# Altium schematic sheet AVR128DB48_Curiosity_Nano_Revision_History.SchDoc
size A3; SheetTitle: Revision History; CompanyName: Microchip Technology Inc.; Organization: Microchip Technology; Address1: 2355 West Chandler Blvd.; Address2: Chandler, AZ  85224; Address4: USA; SheetNumber: 4; SheetTotal: 4; Time: Time
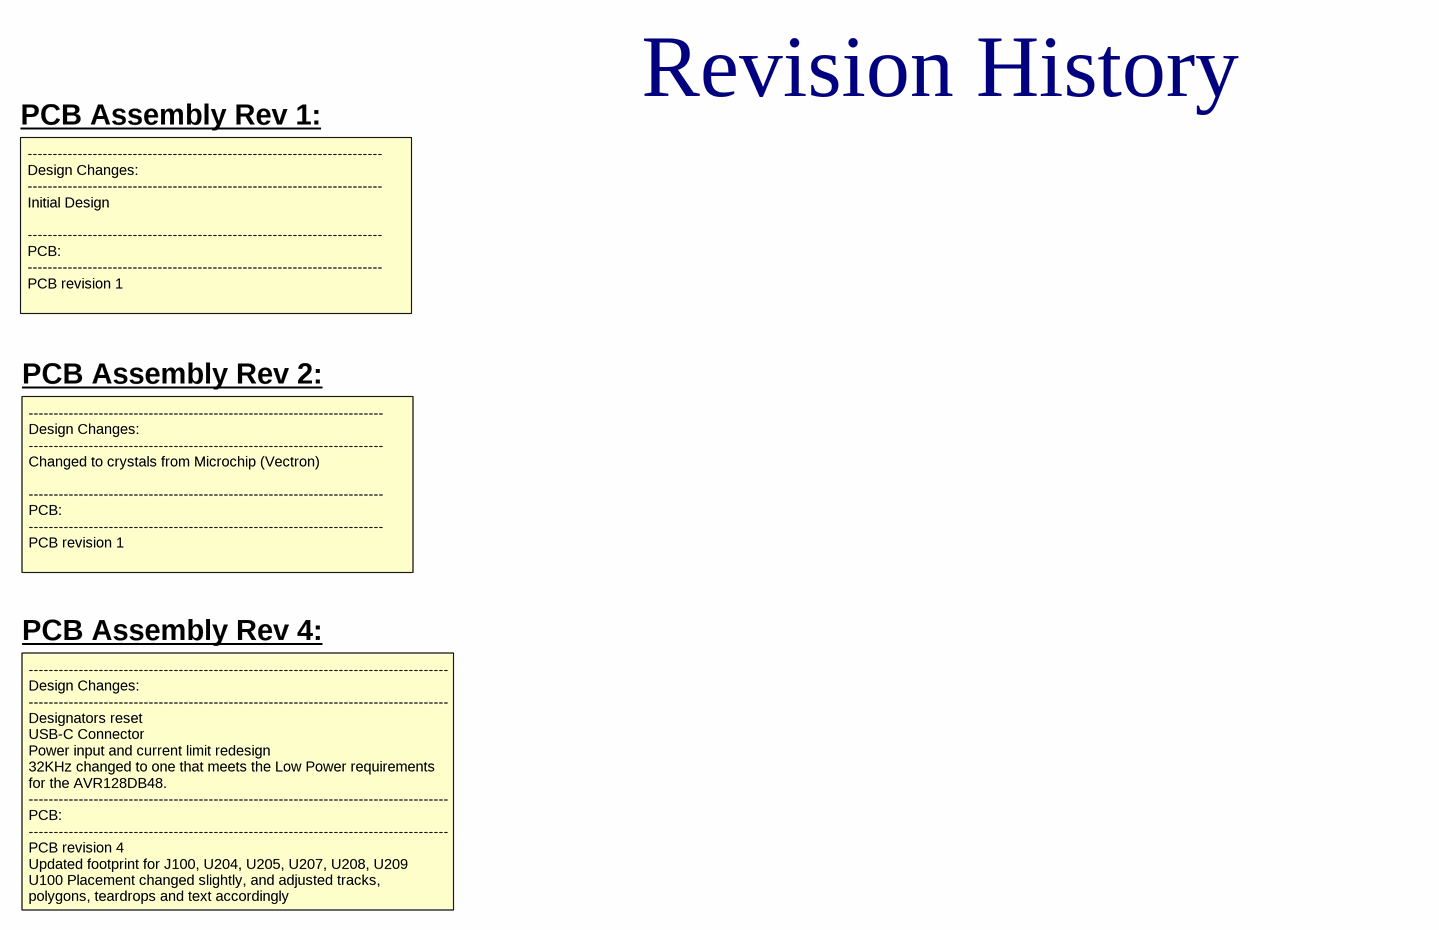
[diagram p0: AVR128DB48_Curiosity_Nano_Revision_History.SchDoc]

## Notes on the sheet
- Revision History
- PCB Assembly Rev 1:
- -----------------------------------------------------------------------
  Design Changes:
  -----------------------------------------------------------------------
  Initial Design
  -----------------------------------------------------------------------
  PCB:
  -----------------------------------------------------------------------
  PCB revision 1
- PCB Assembly Rev 2:
- -----------------------------------------------------------------------
  Design Changes:
  -----------------------------------------------------------------------
  Changed to crystals from Microchip (Vectron)
  -----------------------------------------------------------------------
  PCB:
  -----------------------------------------------------------------------
  PCB revision 1
- PCB Assembly Rev 4:
- ------------------------------------------------------------------------------------
  Design Changes:
  ------------------------------------------------------------------------------------
  Designators reset
  USB-C Connector
  Power input and current limit redesign
  32KHz changed to one that meets the Low Power requirements
  for the AVR128DB48.
  ------------------------------------------------------------------------------------
  PCB:
  ------------------------------------------------------------------------------------
  PCB revision 4
  Updated footprint for J100, U204, U205, U207, U208, U209
  U100 Placement changed slightly, and adjusted tracks,
  polygons, teardrops and text accordingly
- Project Owner:
- PCB Layout Contact:
- PartNumber:
- Project Title
- Variant:
- Sheet Title
- Size
- A3
- SCH #:
- PCB #:
- Rev:
- Date:
- Sheet
- Designed with
- Altium.com <http://go.altium.com/MicrochipLandingPage_Evaluation.html>
- File: